# EAGLE schematic gimbal_controller (EAGLE 7.4.0)
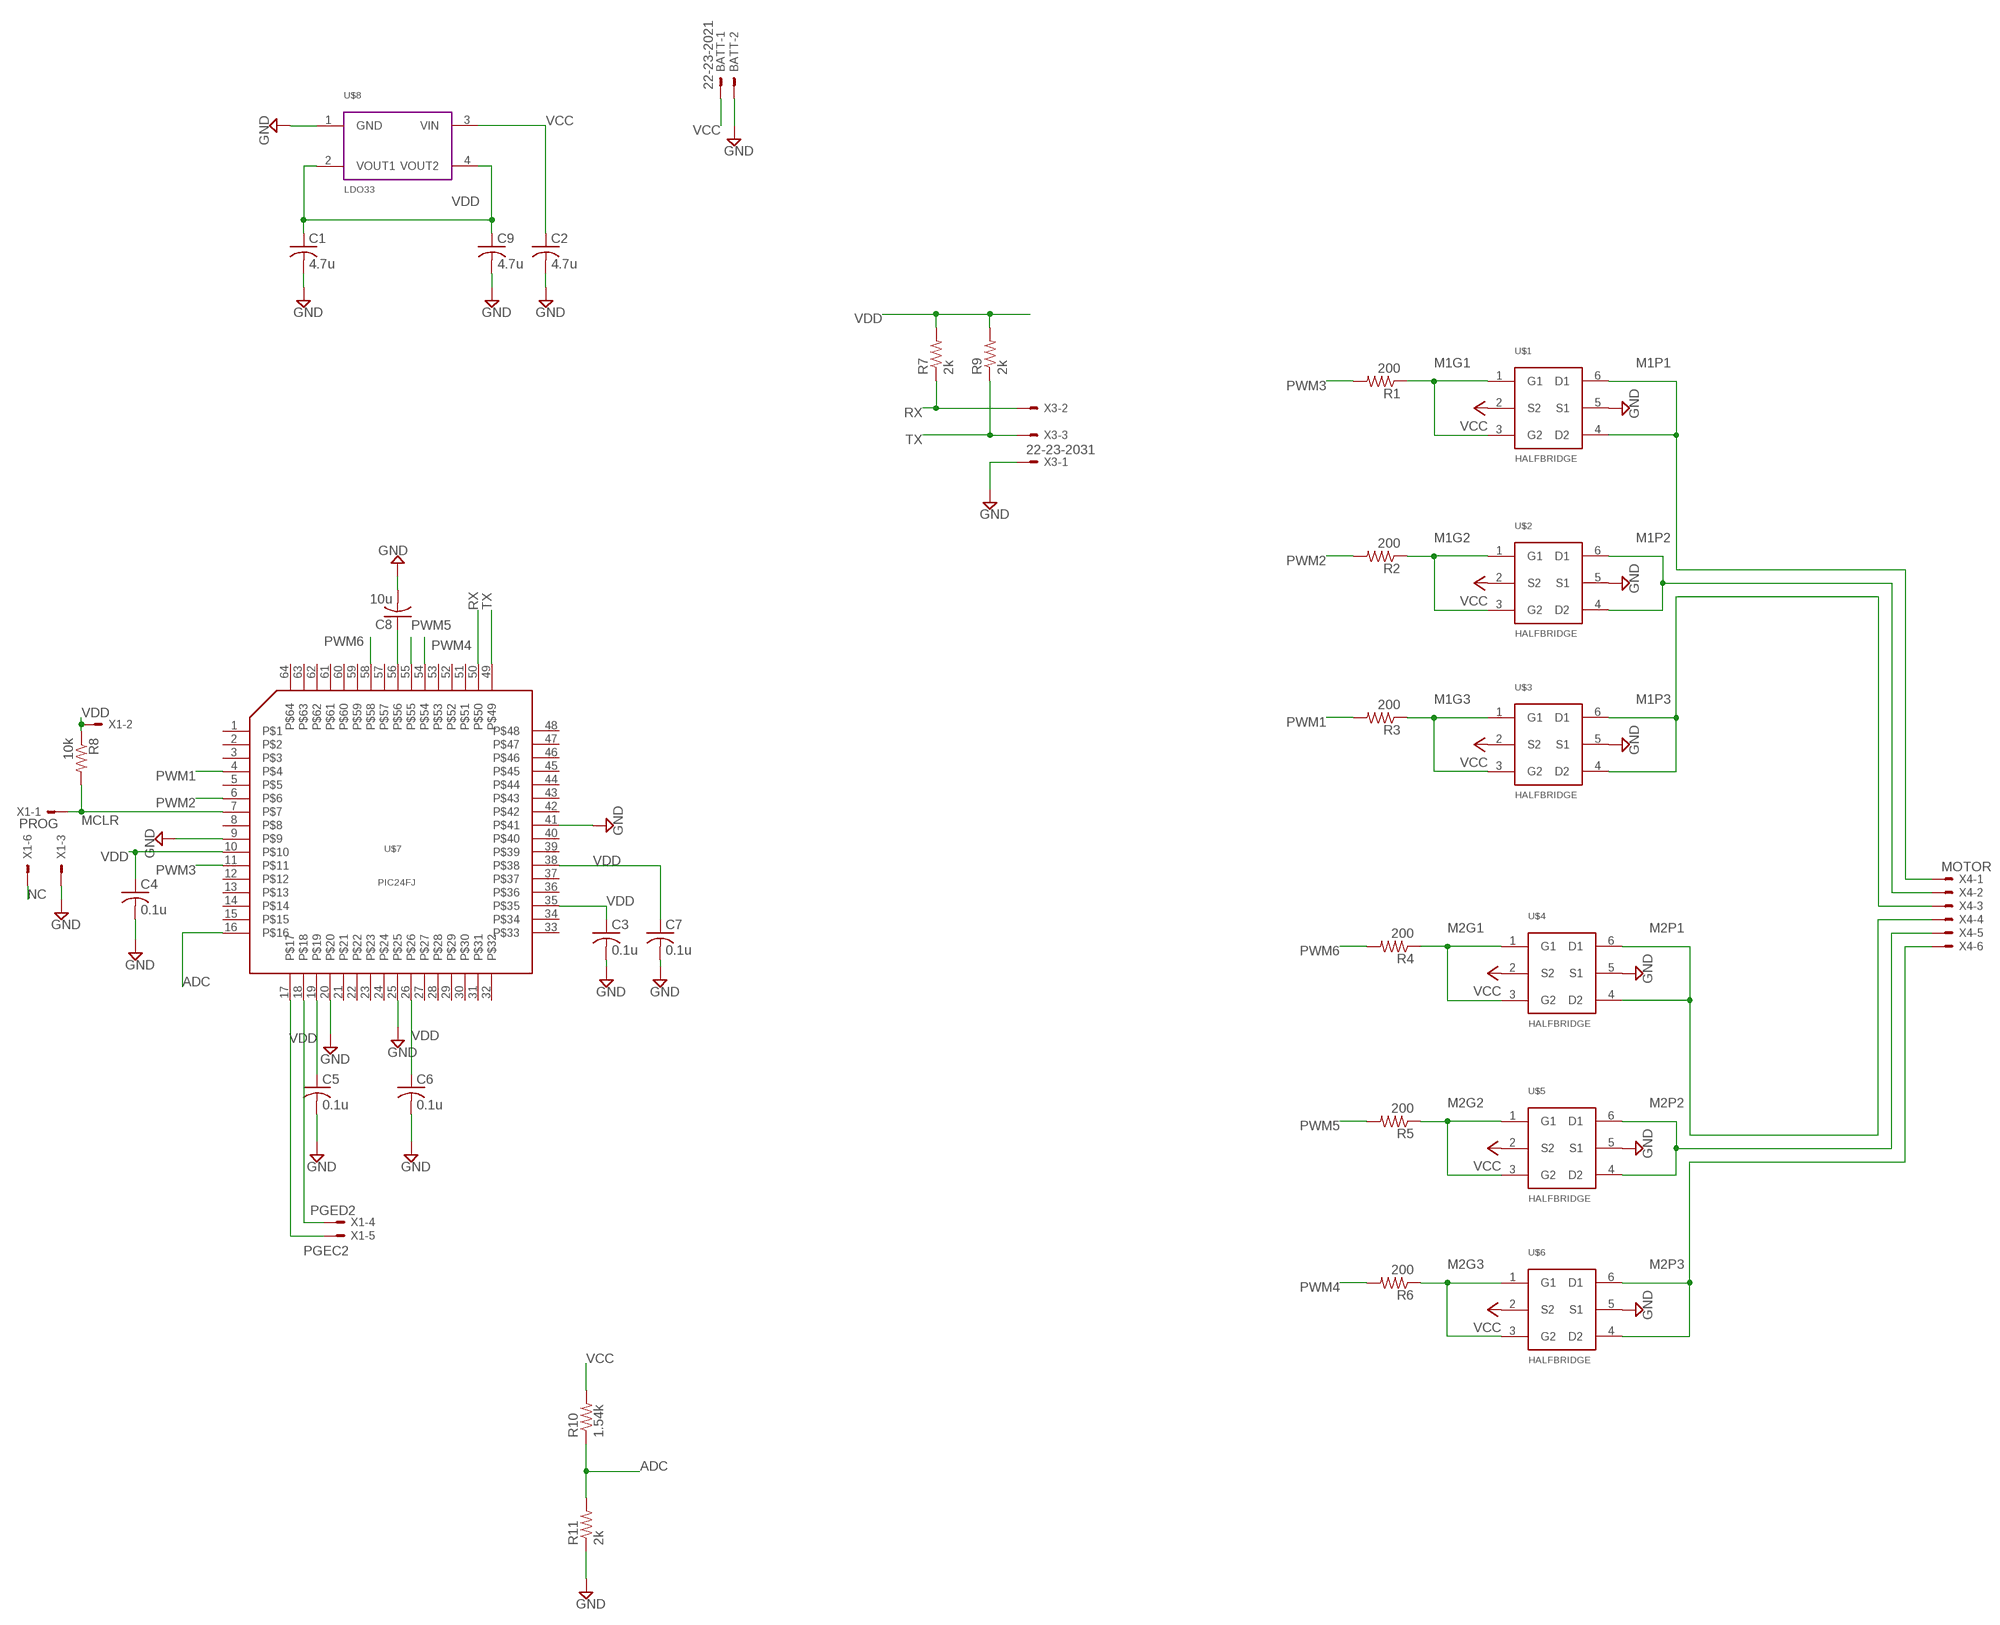
[diagram p0: schematic, sheet 1]

## Parts
BATT  22-23-2021  [22-23-2021]
C1  4.7u  C-USC0805  [C0805]
C2  4.7u  C-USC0805  [C0805]
C3  0.1u  C-USC0805  [C0805]
C4  0.1u  C-USC0805  [C0805]
C5  0.1u  C-USC0805  [C0805]
C6  0.1u  C-USC0805  [C0805]
C7  0.1u  C-USC0805  [C0805]
C8  10u  C-USC0805  [C0805]
C9  4.7u  C-USC0805  [C0805]
R1  200  R-US_R0805  [R0805]
R2  200  R-US_R0805  [R0805]
R3  200  R-US_R0805  [R0805]
R4  200  R-US_R0805  [R0805]
R5  200  R-US_R0805  [R0805]
R6  200  R-US_R0805  [R0805]
R7  2k  R-US_R0805  [R0805]
R8  10k  R-US_R0805  [R0805]
R9  2k  R-US_R0805  [R0805]
R10  1.54k  R-US_R0805  [R0805]
R11  2k  R-US_R0805  [R0805]
U$1  HALFBRIDGE  [SSOT6]
U$2  HALFBRIDGE  [SSOT6]
U$3  HALFBRIDGE  [SSOT6]
U$4  HALFBRIDGE  [SSOT6]
U$5  HALFBRIDGE  [SSOT6]
U$6  HALFBRIDGE  [SSOT6]
U$7  PIC24FJ  [TQFP64-10X10]
U$8  LDO33  [SOT223]
X1  PROG  22-23-2061  [22-23-2061]
X3  22-23-2031  [22-23-2031]
X4  MOTOR  22-23-2061  [22-23-2061]

## Nets
ADC: R10.1 R11.2 U$7.16
GND: BATT.2 C1.2 C2.2 C3.2 C4.2 C5.2 C6.2 C7.2 C8.2 C9.2 R11.1 U$1.5(S1) U$2.5(S1) U$3.5(S1) U$4.5(S1) U$5.5(S1) U$6.5(S1) U$7.9 U$7.20 U$7.25 U$7.41 U$8.1(GND) X1.3 X3.1
M1G1: R1.1 U$1.1(G1) U$1.3(G2)
M1G2: R2.1 U$2.1(G1) U$2.3(G2)
M1G3: R3.1 U$3.1(G1) U$3.3(G2)
M1P1: U$1.4(D2) U$1.6(D1) X4.1
M1P2: U$2.4(D2) U$2.6(D1) X4.2
M1P3: U$3.4(D2) U$3.6(D1) X4.3
M2G1: R4.1 U$4.1(G1) U$4.3(G2)
M2G2: R5.1 U$5.1(G1) U$5.3(G2)
M2G3: R6.1 U$6.1(G1) U$6.3(G2)
M2P1: U$4.4(D2) U$4.6(D1) X4.4
M2P2: U$5.4(D2) U$5.6(D1) X4.5
M2P3: U$6.4(D2) U$6.6(D1) X4.6
MCLR: R8.2 U$7.7 X1.1
N$3: C8.1 U$7.56
NC: X1.6
PGEC2: U$7.17 X1.5
PGED2: U$7.18 X1.4
PWM1: R3.2 U$7.4
PWM2: R2.2 U$7.6
PWM3: R1.2 U$7.11
PWM4: R6.2 U$7.54
PWM5: R5.2 U$7.55
PWM6: R4.2 U$7.58
RX: R7.1 U$7.50 X3.2
TX: R9.1 U$7.49 X3.3
VCC: BATT.1 C2.1 R10.2 U$1.2(S2) U$2.2(S2) U$3.2(S2) U$4.2(S2) U$5.2(S2) U$6.2(S2) U$8.3(VIN)
VDD: C1.1 C3.1 C4.1 C5.1 C6.1 C7.1 C9.1 R7.2 R8.1 R9.2 U$7.10 U$7.19 U$7.26 U$7.35 U$7.38 U$8.2(VOUT1) U$8.4(VOUT2) X1.2
Unconnected: U$7.1 U$7.2 U$7.3 U$7.5 U$7.8 U$7.12 U$7.13 U$7.14 U$7.15 U$7.21 U$7.22 U$7.23 U$7.24 U$7.27 U$7.28 U$7.29 U$7.30 U$7.31 U$7.32 U$7.33 U$7.34 U$7.36 U$7.37 U$7.39 U$7.40 U$7.42 U$7.43 U$7.44 U$7.45 U$7.46 U$7.47 U$7.48 U$7.51 U$7.52 U$7.53 U$7.57 U$7.59 U$7.60 U$7.61 U$7.62 U$7.63 U$7.64

## Library data of the parts
BATT = con-molex:22-23-2021: .100" (2.54mm) Center Header - 2 Pin; MF: MOLEX; MPN: 22-23-2021; OC_FARNELL: 1462926; OC_NEWARK: 25C3832
C1-C9 = resistor:C-US: CAPACITOR, American symbol
R1-R6 R8 = rcl:R-US_: RESISTOR, American symbol
R7 R9-R11 = resistor:R-US_: RESISTOR, American symbol
U$1-U$6 = gibal:HALFBRIDGE
U$7 = gimbal:PIC24FJ
U$8 = gimbal:LDO33
X1 X4 = con-molex:22-23-2061: .100" (2.54mm) Center Header - 6 Pin; MF: MOLEX; MPN: 22-23-2061; OC_FARNELL: 1462922; OC_NEWARK: 27C1933
X3 = con-molex:22-23-2031: .100" (2.54mm) Center Header - 3 Pin; MF: MOLEX; MPN: 22-23-2031; OC_FARNELL: 1462950; OC_NEWARK: 30C0862